# Altium schematic sheet TVS Diode.schdoc
size 127 x 101 mm
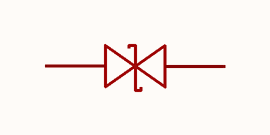
[diagram p0: TVS Diode.schdoc]

## Parts
D?  SMAJ58CA  [SMA_L4.3-W2.6-LS5.0-BI]  (value not drawn)

## Nets

Not connected (* = marked no-connect by the designer): D? 1 2

## Library data of the parts
D? = SMAJ58CA_C148235: Manufacturer: Littelfuse(美国力特); Add into BOM: yes; Reverse Stand-Off Voltage (Vrwm): 58V; Maximum Clamping Voltage: 93.6V; Peak Pulse Current (Ipp): 4.3A; Peak Pulse Power Dissipation (Ppp): 400W; Breakdown Voltage: 64.4V; Type: TVS; Symbol: SMAJ58CA_C148235; Device: SMAJ58CA_C148235; LCSC Part Name: SMAJ58CA; Supplier Part: C148235; Manufacturer Part: SMAJ58CA; Supplier Footprint: SMA(DO-214AC); JLCPCB Part Class: Extended Part; Datasheet: https://atta.szlcsc.com/upload/public/pdf/source/20190402/C374025_5ACE77BC72947DF13CF0CBC7F8B57228.pdf; Supplier: LCSC; Convert to PCB: yes